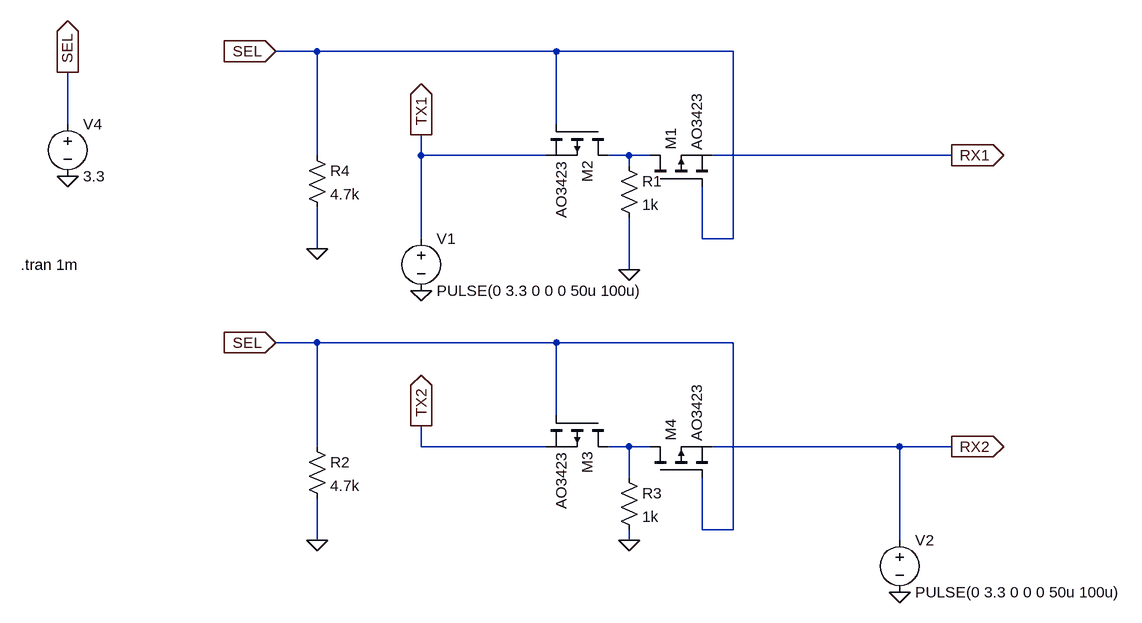
[diagram p0: schematic MOSFET Demux.asc]
MOSFET Demux.asc, the LTspice schematic file:
Version 4
SHEET 1 1476 1220
WIRE -192 368 -256 368
WIRE 176 368 -192 368
WIRE 448 368 176 368
WIRE -576 480 -576 400
WIRE 176 480 176 368
WIRE -192 528 -192 368
WIRE -32 528 -32 496
WIRE 160 528 -32 528
WIRE 288 528 256 528
WIRE 320 528 288 528
WIRE 784 528 416 528
WIRE 288 544 288 528
WIRE -32 656 -32 528
WIRE 400 656 400 576
WIRE 448 656 448 368
WIRE 448 656 400 656
WIRE -192 672 -192 608
WIRE 288 704 288 624
WIRE -192 816 -256 816
WIRE 176 816 -192 816
WIRE 448 816 176 816
WIRE 176 928 176 816
WIRE -192 976 -192 816
WIRE -32 976 -32 944
WIRE 160 976 -32 976
WIRE 288 976 256 976
WIRE 320 976 288 976
WIRE 704 976 416 976
WIRE 784 976 704 976
WIRE 288 1024 288 976
WIRE 400 1104 400 1024
WIRE 448 1104 448 816
WIRE 448 1104 400 1104
WIRE -192 1120 -192 1056
WIRE 288 1120 288 1104
WIRE 704 1120 704 976
FLAG -32 496 TX1
IOPIN -32 496 Out
FLAG 784 528 RX1
IOPIN 784 528 Out
FLAG -576 560 0
FLAG -192 672 0
FLAG -256 368 SEL
IOPIN -256 368 In
FLAG -576 400 SEL
IOPIN -576 400 Out
FLAG 288 704 0
FLAG -32 736 0
FLAG -32 944 TX2
IOPIN -32 944 Out
FLAG 784 976 RX2
IOPIN 784 976 Out
FLAG -192 1120 0
FLAG -256 816 SEL
IOPIN -256 816 In
FLAG 288 1120 0
FLAG 704 1200 0
SYMBOL res -208 512 R0
SYMATTR InstName R4
SYMATTR Value 4.7k
SYMBOL voltage -576 464 R0
WINDOW 123 0 0 Left 0
WINDOW 39 0 0 Left 0
SYMATTR InstName V4
SYMATTR Value 3.3
SYMBOL voltage -32 640 R0
WINDOW 123 0 0 Left 0
WINDOW 39 0 0 Left 0
SYMATTR InstName V1
SYMATTR Value PULSE(0 3.3 0 0 0 50u 100u)
SYMBOL pmos 256 480 R90
SYMATTR InstName M2
SYMATTR Value AO3423
SYMBOL pmos 320 576 R270
SYMATTR InstName M1
SYMATTR Value AO3423
SYMBOL res 272 528 R0
SYMATTR InstName R1
SYMATTR Value 1k
SYMBOL res -208 960 R0
SYMATTR InstName R2
SYMATTR Value 4.7k
SYMBOL voltage 704 1104 R0
WINDOW 123 0 0 Left 0
WINDOW 39 0 0 Left 0
SYMATTR InstName V2
SYMATTR Value PULSE(0 3.3 0 0 0 50u 100u)
SYMBOL pmos 256 928 R90
SYMATTR InstName M3
SYMATTR Value AO3423
SYMBOL pmos 320 1024 R270
SYMATTR InstName M4
SYMATTR Value AO3423
SYMBOL res 272 1008 R0
SYMATTR InstName R3
SYMATTR Value 1k
TEXT -648 696 Left 2 !.tran 1m

The netlist it stands for:
* MOSFET Demux.asc
R4 SEL 0 4.7k
V4 SEL 0 3.3
V1 TX1 0 PULSE(0 3.3 0 0 0 50u 100u)
M2 N001 SEL TX1 TX1 AO3423
M1 N001 SEL RX1 RX1 AO3423
R1 N001 0 1k
R2 SEL 0 4.7k
V2 RX2 0 PULSE(0 3.3 0 0 0 50u 100u)
M3 N002 SEL TX2 TX2 AO3423
M4 N002 SEL RX2 RX2 AO3423
R3 N002 0 1k
.model NMOS NMOS
.model PMOS PMOS
.lib standard.mos
.tran 1m
.backanno
.end